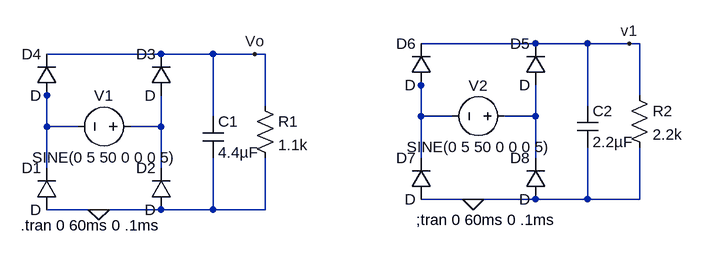
[diagram p0: schematic Versuch5_c.asc]
Versuch5_c.asc, the LTspice schematic file:
Version 4
SHEET 1 964 680
WIRE 736 64 560 64
WIRE 816 64 736 64
WIRE 880 64 816 64
WIRE 896 64 880 64
WIRE 160 80 -16 80
WIRE 240 80 160 80
WIRE 304 80 240 80
WIRE 320 80 304 80
WIRE 560 128 560 112
WIRE -16 144 -16 128
WIRE 896 144 896 64
WIRE 320 160 320 80
WIRE 816 160 816 64
WIRE 240 176 240 80
WIRE 560 176 560 128
WIRE 608 176 560 176
WIRE 736 176 736 128
WIRE 736 176 688 176
WIRE -16 192 -16 144
WIRE 32 192 -16 192
WIRE 160 192 160 144
WIRE 160 192 112 192
WIRE 560 240 560 176
WIRE 736 240 736 176
WIRE -16 256 -16 192
WIRE 160 256 160 192
WIRE 640 304 560 304
WIRE 736 304 640 304
WIRE 816 304 816 224
WIRE 816 304 736 304
WIRE 896 304 896 224
WIRE 896 304 816 304
WIRE 64 320 -16 320
WIRE 160 320 64 320
WIRE 240 320 240 240
WIRE 240 320 160 320
WIRE 320 320 320 240
WIRE 320 320 240 320
FLAG 64 320 0
FLAG 304 80 Vo
FLAG 640 304 0
FLAG 880 64 v1
SYMBOL diode 176 144 R180
WINDOW 0 24 64 Left 2
WINDOW 3 24 0 Left 2
SYMATTR InstName D3
SYMBOL voltage 128 192 R90
WINDOW 0 -32 56 VBottom 2
WINDOW 3 32 56 VTop 2
WINDOW 123 0 0 Left 0
WINDOW 39 0 0 Left 0
SYMATTR InstName V1
SYMATTR Value SINE(0 5 50 0 0 0 5)
SYMBOL diode 0 144 R180
WINDOW 0 24 64 Left 2
WINDOW 3 24 0 Left 2
SYMATTR InstName D4
SYMBOL diode 0 320 R180
WINDOW 0 24 64 Left 2
WINDOW 3 24 0 Left 2
SYMATTR InstName D1
SYMBOL diode 176 320 R180
WINDOW 0 24 64 Left 2
WINDOW 3 24 0 Left 2
SYMATTR InstName D2
SYMBOL res 304 144 R0
SYMATTR InstName R1
SYMATTR Value 1.1k
SYMBOL cap 224 176 R0
SYMATTR InstName C1
SYMATTR Value 4.4µF
SYMBOL diode 752 128 R180
WINDOW 0 24 64 Left 2
WINDOW 3 24 0 Left 2
SYMATTR InstName D5
SYMBOL voltage 704 176 R90
WINDOW 0 -32 56 VBottom 2
WINDOW 3 32 56 VTop 2
WINDOW 123 0 0 Left 0
WINDOW 39 0 0 Left 0
SYMATTR InstName V2
SYMATTR Value SINE(0 5 50 0 0 0 5)
SYMBOL diode 576 128 R180
WINDOW 0 24 64 Left 2
WINDOW 3 24 0 Left 2
SYMATTR InstName D6
SYMBOL diode 576 304 R180
WINDOW 0 24 64 Left 2
WINDOW 3 24 0 Left 2
SYMATTR InstName D7
SYMBOL diode 752 304 R180
WINDOW 0 24 64 Left 2
WINDOW 3 24 0 Left 2
SYMATTR InstName D8
SYMBOL res 880 128 R0
SYMATTR InstName R2
SYMATTR Value 2.2k
SYMBOL cap 800 160 R0
SYMATTR InstName C2
SYMATTR Value 2.2µF
TEXT -56 344 Left 2 !.tran 0 60ms 0 .1ms
TEXT 552 336 Left 2 !;tran 0 60ms 0 .1ms

The netlist it stands for:
* Versuch5_c.asc
D3 N004 Vo D
V1 N004 N002 SINE(0 5 50 0 0 0 5)
D4 N002 Vo D
D1 0 N002 D
D2 0 N004 D
R1 Vo 0 1.1k
C1 Vo 0 4.4µF
D5 N003 v1 D
V2 N003 N001 SINE(0 5 50 0 0 0 5)
D6 N001 v1 D
D7 0 N001 D
D8 0 N003 D
R2 v1 0 2.2k
C2 v1 0 2.2µF
.model D D
.lib standard.dio
.tran 0 60ms 0 .1ms
;tran 0 60ms 0 .1ms
.backanno
.end